# EAGLE design ladybug (EAGLE 7.3.0)
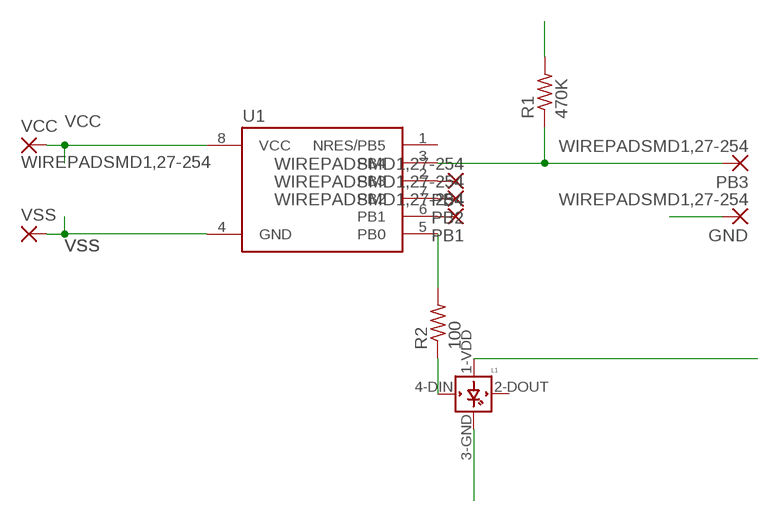
[diagram p0: schematic, sheet 1]

## Parts
GND  WIREPADSMD1,27-254  [SMD1,27-2,54]
L1  WS2812B  [WS2812B]
PB1  WIREPADSMD1,27-254  [SMD1,27-2,54]
PB2  WIREPADSMD1,27-254  [SMD1,27-2,54]
PB3  WIREPADSMD1,27-254  [SMD1,27-2,54]
PB4  WIREPADSMD1,27-254  [SMD1,27-2,54]
R1  470K  R-US_M1206  [M1206]
R2  100  R-US_M1206  [M1206]
U1  ATTINY85-20S  [SOIC8_EIAJ_208MIL]
VCC  WIREPADSMD1,27-254  [SMD1,27-2,54]
VSS  WIREPADSMD1,27-254  [SMD1,27-2,54]

## Nets
N$1: R2.2 U1.5(PB0)
N$2: L1.4-DIN(DIN) R2.1
N$3: PB4.1(P) U1.2(PB3)
N$4: PB1.1(P) U1.6(PB1)
N$5: PB2.1(P) U1.7(PB2)
PB3: PB3.1(P) R1.1 U1.3(PB4)
VCC: L1.1-VDD(VDD) R1.2 U1.8(VCC) VCC.1(P)
VSS: GND.1(P) L1.3-GND(GND) U1.4(GND) VSS.1(P)
Unconnected: L1.2-DOUT(DOUT) U1.1(NRES/PB5)

## Library data of the parts
GND PB1-PB4 VCC VSS = wirepad:WIREPAD: Wire PAD connect wire on PCB
L1 = adafruit:WS2812B
R1 R2 = adafruit:R-US_: RESISTOR, American symbol
U1 = _hhn_attiny25_45_85:ATTINY85*: ATMEL ATtiny 85 Packages: P = PDIP 08 30mil S = SOIC 08 EIAJ 208mil Technologies Note: for complete ordering code (temp. range, finish, tape&reel etc.) see www.atmel.com • Supply Voltage: V = (1.8…5.5)V | [blank] = (2.7…5.5)V • Speed: 10 = 10 MHz | 20 = 20 MHz Author: Dipl.-Ing. FH Rainer Bayer HHN Hochschule Heilbronn (Heilbronn University), rainer.bayer@hs-heilbronn.de Ingenieurbüro ing-rb, mail@ing-rb.de

## Board
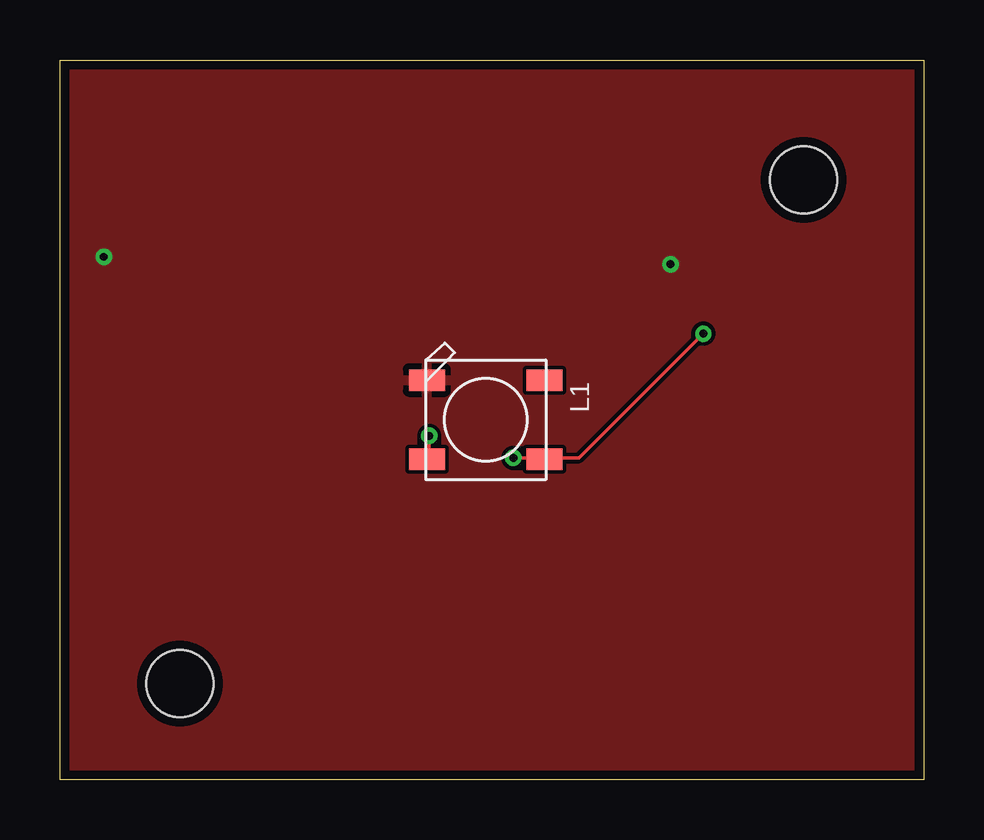
[diagram p1: board, top side]
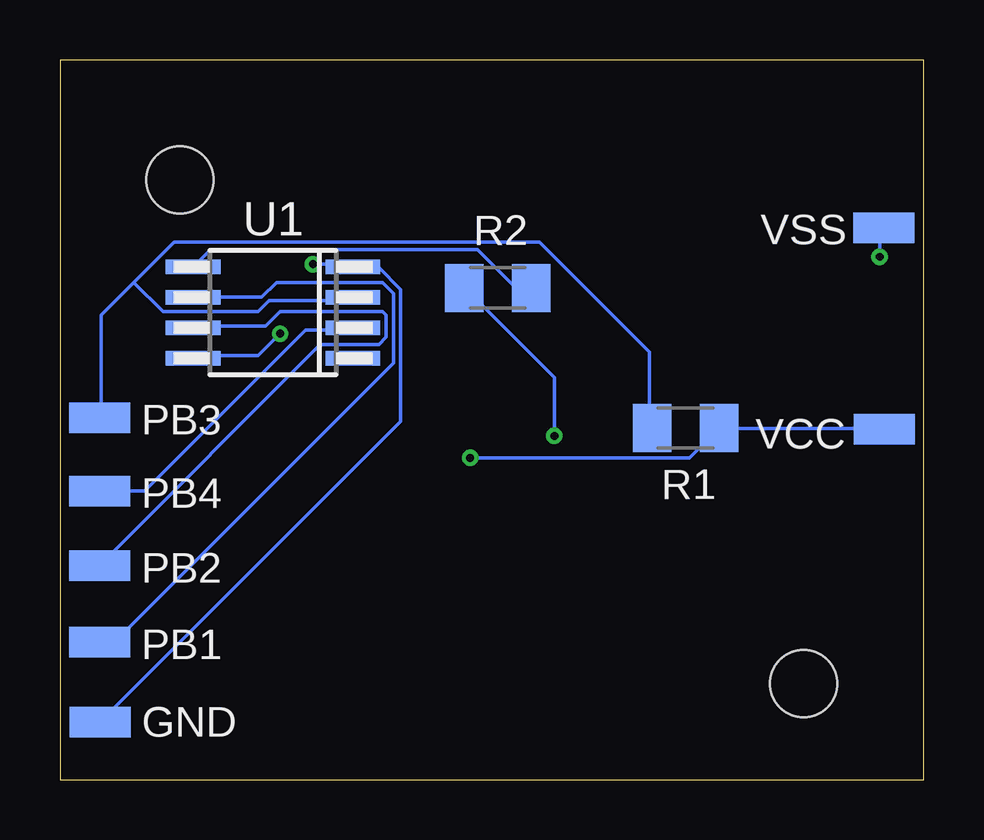
[diagram p2: board, bottom side, seen from below]

Size 36 x 30 mm. Coordinates in mm from the lower left corner, seen from the top.
Outline: 0,0 0,30 36,30 36,0 0,0
Copper layers (1*16): Top 0.0356mm / dielectric 1.5011mm / Bottom 0.0356mm
Design rules "LaenPCBOrder": minimum track width 6mil, minimum drill 13mil, track to track 6mil, track to pad 6mil, pad to pad 6mil, via to via 6mil, smd to smd 6mil, copper to edge 15mil, drill to drill 6mil, minimum pad ring 7mil, minimum via ring 7mil, stop-mask expansion 3mil, vias tented up to drill 0mil, thermal gap 10mil
Holes 2.8 mm at 5,4 31,25

### Footprints (pad centres in the part's own frame; a part is rotated, then mirrored left to right if it is on the bottom)
SMD1,27-2,54 = smd 1.27 x 2.54: 1 0,0
WS2812B = smd 1.5 x 0.9: 1-VDD 2.45,-1.65; 2-DOUT 2.45,1.65; 3-GND -2.45,1.65; 4-DIN -2.45,-1.65
M1206 = smd 1.6 x 2: 1 -1.4,0; 2 1.4,0
SOIC8_EIAJ_208MIL = smd 0.6 x 2.286: 1 -1.905,-3.33; 2 -0.635,-3.33; 3 0.635,-3.33; 4 1.905,-3.33; 5 1.905,3.33; 6 0.635,3.33; 7 -0.635,3.33; 8 -1.905,3.33

### Placement (x,y rotation side)
GND  34.33,2.39 90 bottom
L1  17.75,15 0 top
PB1  34.34,5.72 90 bottom
PB2  34.34,8.91 90 bottom
PB3  34.34,15.09 90 bottom
PB4  34.34,12.03 90 bottom
R1  9.92,14.66 0 bottom
R2  17.75,20.5 0 bottom
U1  27.12,19.47 90 bottom
VCC  1.64,14.6 90 bottom
VSS  1.65,23 270 bottom

### Tracks (layer width: path | path; a pad name or v marks a point on that pad's centre or on a via)
N$1
  Bottom 0.152: R2.2 16.46,20.57 17.07,20.57 18.59,22.1 29.72,22.1 30.33,21.49 U1.5
N$2  (via drill 0.33)
  Top 0.152: v15.39,14.33 15.39,13.41 L1.4-DIN
  Bottom 0.152: v15.39,14.33 15.39,16.76 19.05,20.42 R2.1
N$3
  Bottom 0.152: U1.2 23.93,18.75 25.76,18.75 32.46,12.04 34.29,12.04 PB4.1
N$4
  Bottom 0.152: U1.6 30.33,20.12 27.58,20.12 26.98,20.73 22.55,20.73 22.1,20.27 22.1,17.37 33.68,5.79 34.29,5.79 PB1.1
N$5
  Bottom 0.152: U1.7 30.33,18.9 27.43,18.9 26.82,19.51 22.55,19.51 22.4,19.36 22.4,18.44 22.71,18.14 25.15,18.14 34.29,8.99 PB2.1
PB3
  Bottom 0.152: 32.92,20.73 34.29,19.36 34.29,15.24 PB3.1 | 32.92,20.73 31.24,22.4 16,22.4 11.43,17.83 11.43,14.78 R1.1 | 32.92,20.73 31.7,19.51 27.74,19.51 27.28,19.96 23.93,19.96 U1.3
VCC  (via drill 0.33)
  Top 0.152: v18.9,13.41 20.12,13.41 L1.1-VDD 20.27,13.41 21.64,13.41 v26.82,18.59
  Bottom 0.152: v18.9,13.41 9.75,13.41 8.53,14.63 R1.2 8.38,14.63 1.98,14.63 VCC.1 | v26.82,18.59 27.74,17.68 30.33,17.68 U1.8
VSS  (via drill 0.33)
  Bottom 0.152: v25.45,21.49 23.93,21.49 U1.4 23.77,21.34 22.71,21.34 21.79,20.42 21.79,14.94 34.14,2.59 GND.1 | v1.83,21.79 1.83,22.86 VSS.1
  pour Top: 0,30 36,30 36,0 0,0

### Text on the board
_tNames: C1 | U1 | LED1 | R1 | VDD | VCC | PB2 | PB1 | PB4 | PB3